# EAGLE schematic MPU-6050_BreakoutV11 (EAGLE 6.1)
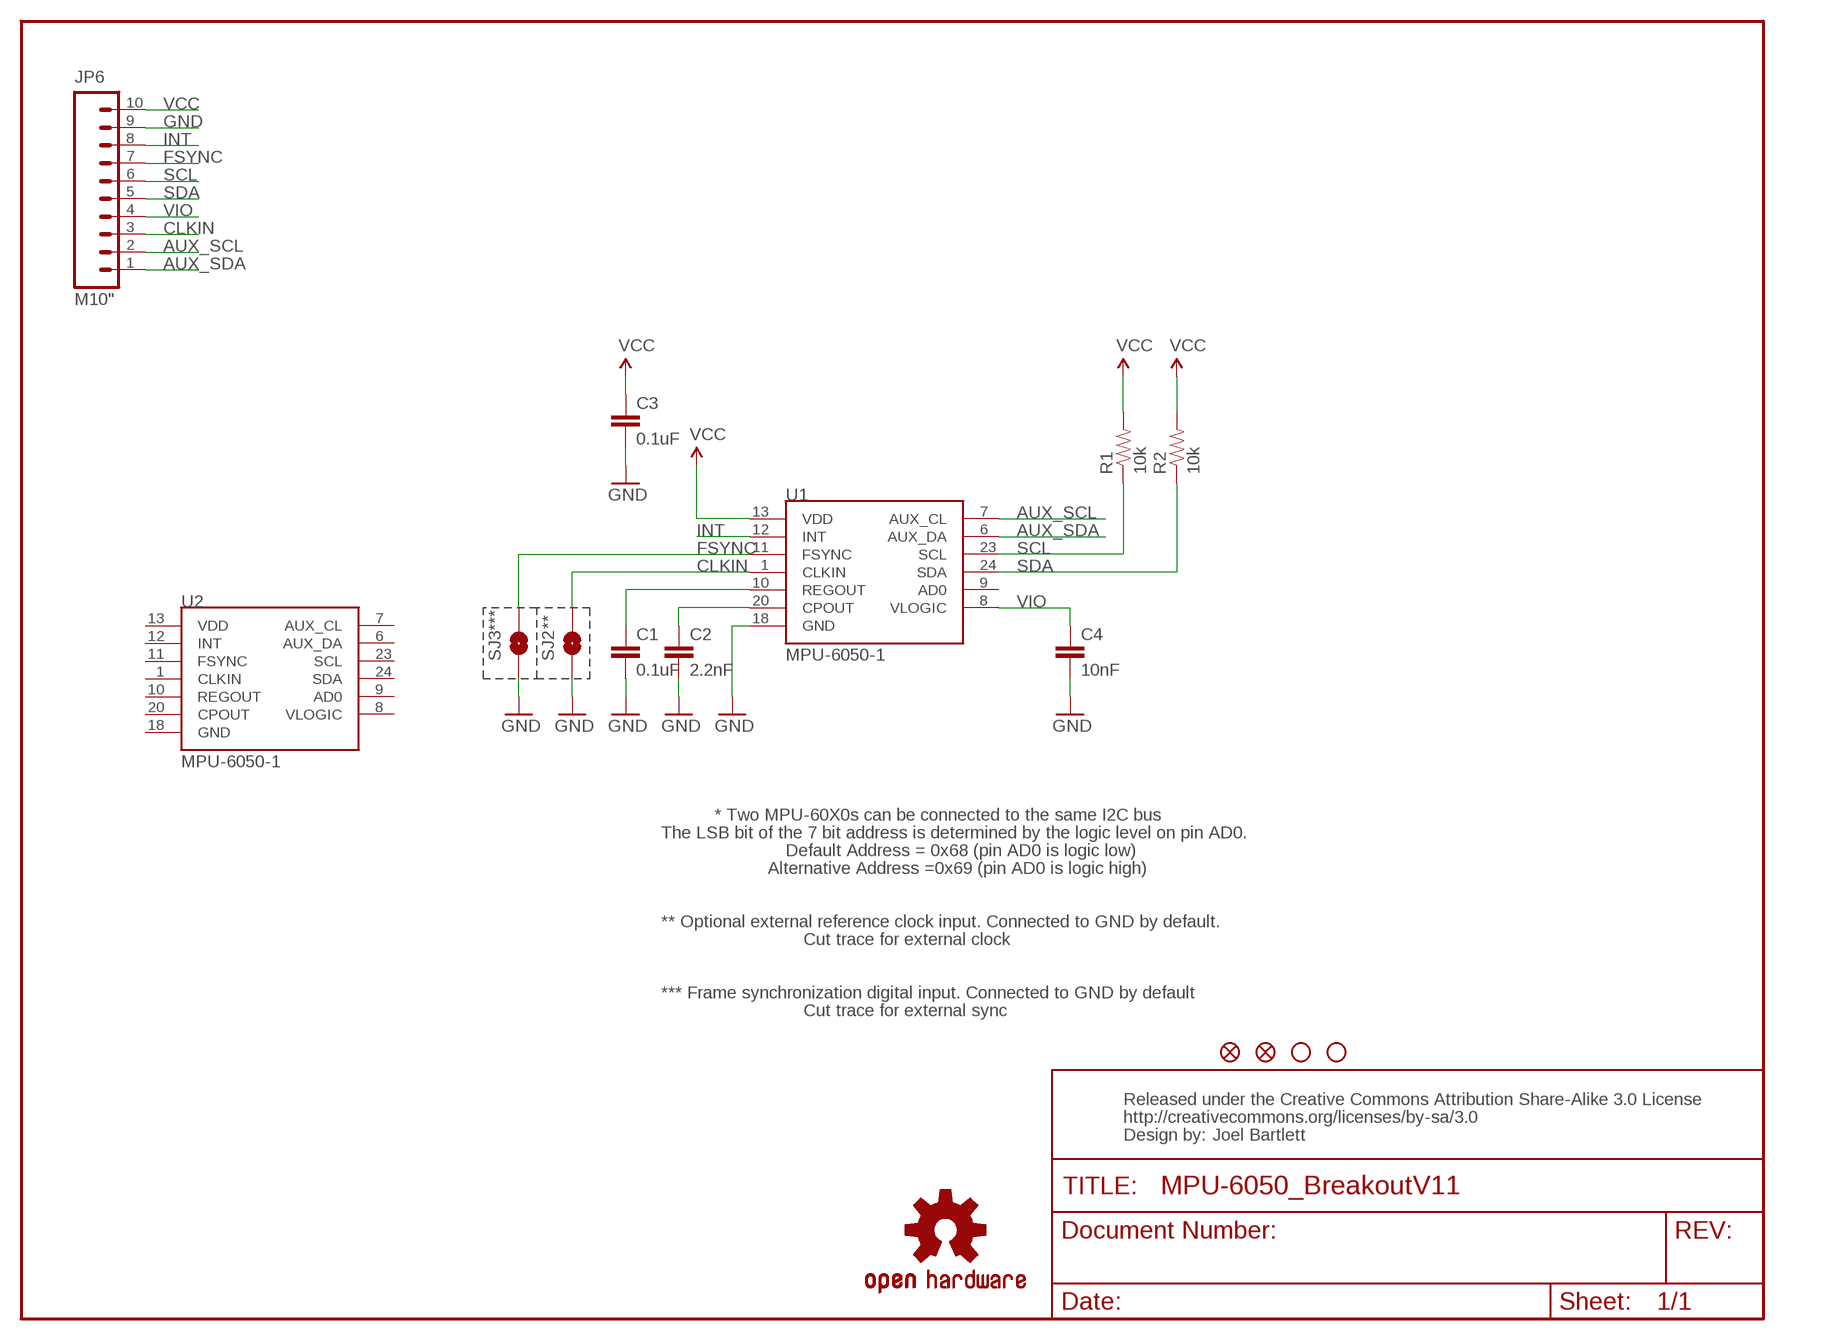
[diagram p0: schematic, sheet 1]

## Parts
C1  0.1uF  CAP0402-CAP  [0402-CAP]
C2  2.2nF  CAP0402-CAP  [0402-CAP]
C3  0.1uF  CAP0402-CAP  [0402-CAP]
C4  10nF  CAP0402-CAP  [0402-CAP]
JP2  FIDUCIALUFIDUCIAL  [MICRO-FIDUCIAL]
JP3  STAND-OFFTIGHT  [STAND-OFF-TIGHT]
JP4  STAND-OFFTIGHT  [STAND-OFF-TIGHT]
JP5  FIDUCIALUFIDUCIAL  [MICRO-FIDUCIAL]
JP6  M10"  [1X10]
R1  10k  RESISTOR0402-RES  [0402-RES]
R2  10k  RESISTOR0402-RES  [0402-RES]
SJ2  SOLDERJUMPERTRACE  [SJ_2S-TRACE]
SJ3  SOLDERJUMPERTRACE  [SJ_2S-TRACE]
U1  MPU-6050-1  [QFN-24-4MM2]
U2  MPU-6050-1  [QFN-24-4MM2]
U3  CREATIVE_COMMONS  [CREATIVE_COMMONS]
U$1  OSHW-LOGOS  [OSHW-LOGO-S]

## Nets
AUX_SCL: JP6.2 U1.7(AUX_CL)
AUX_SDA: JP6.1 U1.6(AUX_DA)
CLKIN: JP6.3 SJ2.2 U1.1(CLKIN)
FSYNC: JP6.7 SJ3.2 U1.11(FSYNC)
GND: C1.2 C2.2 C3.2 C4.2 JP6.9 SJ2.1 SJ3.1 U1.18(GND)
INT: JP6.8 U1.12(INT)
N$3: C2.1 U1.20(CPOUT)
N$5: C1.1 U1.10(REGOUT)
SCL: JP6.6 R1.1 U1.23(SCL)
SDA: JP6.5 R2.1 U1.24(SDA)
VCC: C3.1 JP6.10 R1.2 R2.2 U1.13(VDD)
VIO: C4.1 JP6.4 U1.8(VLOGIC)
Unconnected: U1.9(AD0) U2.1(CLKIN) U2.6(AUX_DA) U2.7(AUX_CL) U2.8(VLOGIC) U2.9(AD0) U2.10(REGOUT) U2.11(FSYNC) U2.12(INT) U2.13(VDD) U2.18(GND) U2.20(CPOUT) U2.23(SCL) U2.24(SDA)

## Notes on the sheet
- *** | **
- * Two MPU-60X0s can be connected to the same I2C bus
- The LSB bit of the 7 bit address is determined by the logic level on pin AD0.
- Default Address = 0x68 (pin AD0 is logic low)
- Alternative Address =0x69 (pin AD0 is logic high)
- ** Optional external reference clock input. Connected to GND by default.
- Cut trace for external clock
- *** Frame synchronization digital input. Connected to GND by default
- Cut trace for external sync
- Joel Bartlett

## Library data of the parts
C1-C4 = SparkFun:CAP: Capacitor Standard 0603 ceramic capacitor, and 0.1" leaded capacitor.
JP2 JP5 = SparkFun:FIDUCIAL: Fiducial Alignment Points Various fiducial points for machine vision alignment.
JP3 JP4 = SparkFun:STAND-OFF: Stand Off This is the mechanical footprint for a #4 phillips button head screw. Use the keepout ring to avoid running the screw head into surrounding components. SKU : PRT-00447
JP6 = SparkFun:M10: Header 10 Standard 10-pin 0.1" header. Use with straight break away headers (SKU : PRT-00116), right angle break away headers (PRT-00553), swiss pins (PRT-00743), machine pins (PRT-00117), and female headers (PRT-00115).
R1 R2 = SparkFun:RESISTOR: Resistor Basic schematic elements and footprints for 0603, 1206, and PTH resistors.
SJ2 SJ3 = SparkFun:SOLDERJUMPER: Solder Jumper Standard SMD solder jumper. Used to automate production. Two varients : Normally Open and Normally Closed are the same, but have different paste layers. NC will have a large amount of paste and should jumper during reflow.
U1 U2 = Testing:MPU-6050
U3 = SparkFun:CREATIVE_COMMONS
U$1 = SparkFun:OSHW-LOGO: Open Source Hardware Logo This logo indicates the piece of hardware it is found on incorporates a OSHW license and/or adheres to the definition of open source hardware found here: http://freedomdefined.org/OSHW

## Net classes
0 Default: width 0.203 mm
1 vcc: width 0.254 mm
2 GND: width 0.813 mm